# Altium schematic sheet Connectors.SchDoc
size A; SheetNumber: 4; SheetTotal: 6
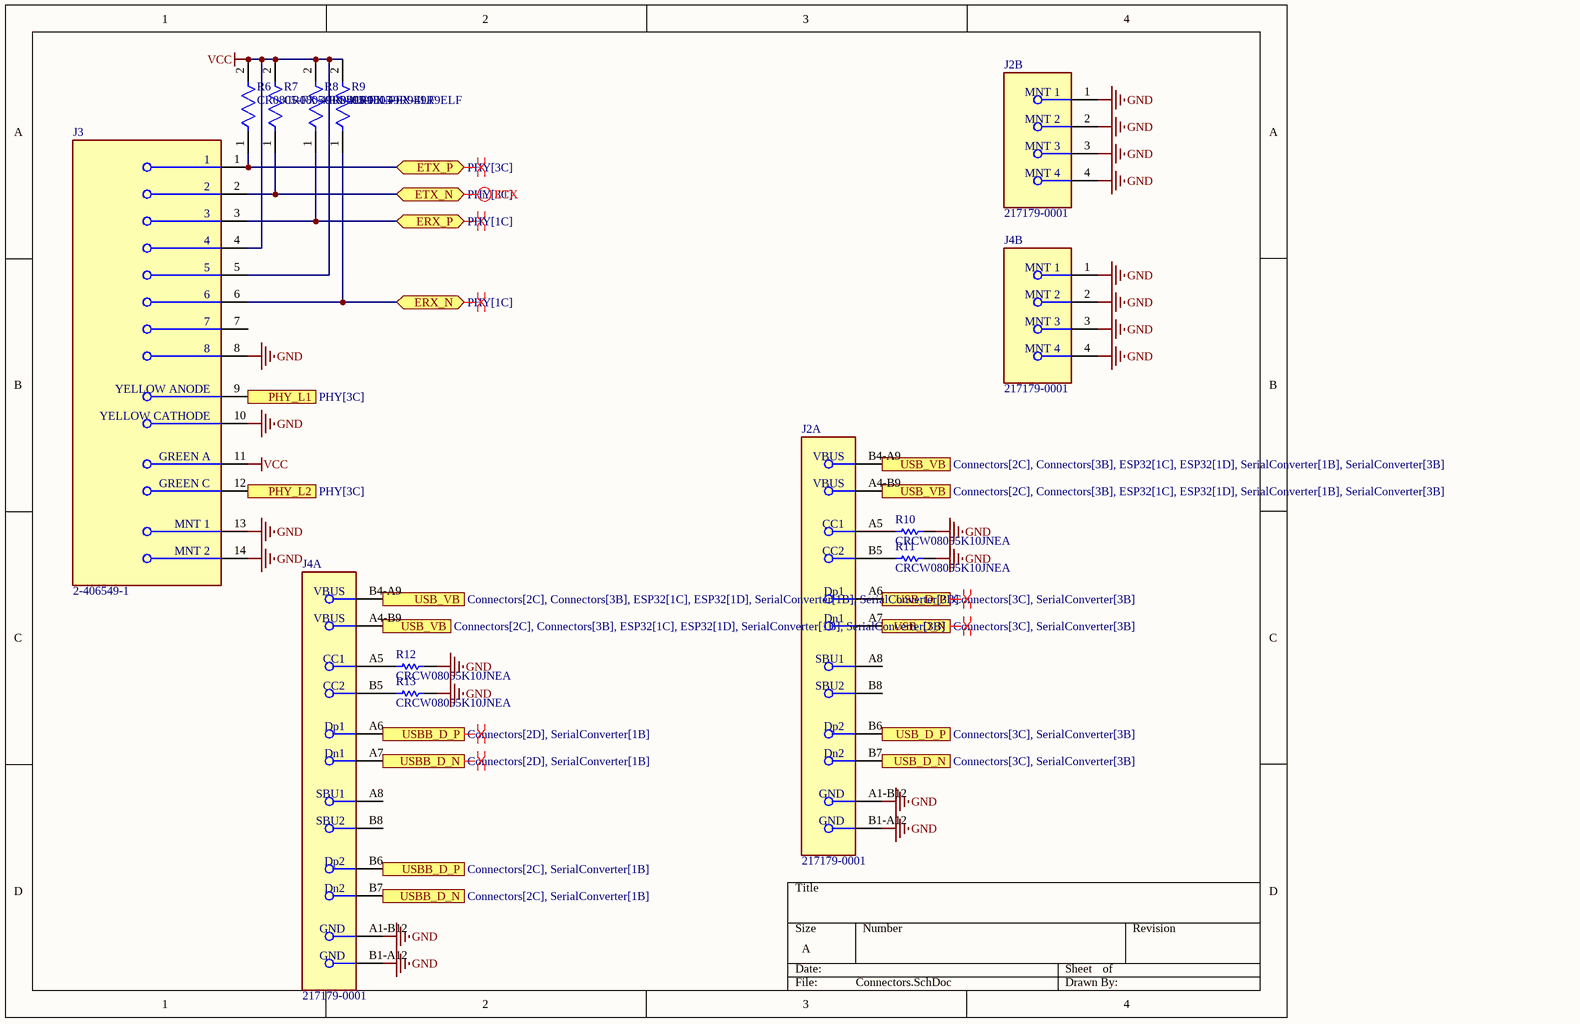
[diagram p0: Connectors.SchDoc]

## Parts
J2  217179-0001  [FP-217179-0001-MFG]  (parts A,B of 2)
J3  2-406549-1  [FP-2-406549-1-MFG]
J4  217179-0001  [FP-217179-0001-MFG]  (parts A,B of 2)
R6  CR0805-FX-49R9ELF  [FP-CR0805-MFG]
R7  CR0805-FX-49R9ELF  [FP-CR0805-MFG]
R8  CR0805-FX-49R9ELF  [FP-CR0805-MFG]
R9  CR0805-FX-49R9ELF  [FP-CR0805-MFG]
R10  CRCW08055K10JNEA  [RESC2013X50X30LL20T20]
R11  CRCW08055K10JNEA  [RESC2013X50X30LL20T20]
R12  CRCW08055K10JNEA  [RESC2013X50X30LL20T20]
R13  CRCW08055K10JNEA  [RESC2013X50X30LL20T20]

## Ports
ERX_N (bidir, see PHY[1C]), ERX_P (bidir, see PHY[1C]), ETX_N (bidir, see PHY[3C]), ETX_P (bidir, see PHY[3C]), PHY_L1 (in, see PHY[3C]), PHY_L2 (out, see PHY[3C]), USB_D_N (see Connectors[3C], SerialConverter[3B]), USB_D_P (see Connectors[3C], SerialConverter[3B]), USB_VB (see Connectors[2C], Connectors[3B], ESP32[1C], ESP32[1D], SerialConverter[1B], SerialConverter[3B]), USBB_D_N (see Connectors[2C], SerialConverter[1B]), USBB_D_N (see Connectors[2D], SerialConverter[1B]), USBB_D_P (see Connectors[2C], SerialConverter[1B]), USBB_D_P (see Connectors[2D], SerialConverter[1B])

## Nets
GND: J2.1(MNT_1) J2.2(MNT_2) J2.3(MNT_3) J2.4(MNT_4) J2.A1-B12(GND) J2.B1-A12(GND) J3.8 J3.10(YELLOW_CATHODE) J3.13(MNT_1) J3.14(MNT_2) J4.1(MNT_1) J4.2(MNT_2) J4.3(MNT_3) J4.4(MNT_4) J4.A1-B12(GND) J4.B1-A12(GND) R10.2 R11.2 R12.2 R13.2
VCC: J3.4 J3.5 J3.11(GREEN_A) R6.2 R7.2 R8.2 R9.2
ERX_N: J3.6 R9.1 ; port ERX_N
ERX_P: J3.3 R8.1 ; port ERX_P
ETX_N: J3.2 R7.1 ; port ETX_N
ETX_P: J3.1 R6.1 ; port ETX_P
PHY_L1: J3.9(YELLOW_ANODE) ; port PHY_L1
PHY_L2: J3.12(GREEN_C) ; port PHY_L2
USB_D_N: J2.A7(Dn1) J2.B7(Dn2) ; port USB_D_N
USB_D_P: J2.A6(Dp1) J2.B6(Dp2) ; port USB_D_P
USB_VB: J2.A4-B9(VBUS) J2.B4-A9(VBUS) J4.A4-B9(VBUS) J4.B4-A9(VBUS) ; port USB_VB
USBB_D_N: J4.A7(Dn1) J4.B7(Dn2) ; port USBB_D_N
USBB_D_P: J4.A6(Dp1) J4.B6(Dp2) ; port USBB_D_P
NetJ2_A5: J2.A5(CC1) R10.1
NetJ2_B5: J2.B5(CC2) R11.1
NetJ4_A5: J4.A5(CC1) R12.1
NetJ4_B5: J4.B5(CC2) R13.1

Not connected (* = marked no-connect by the designer): J2 A8(SBU1) B8(SBU2); J3 7; J4 A8(SBU1) B8(SBU2)

## Layout directives
differential pair: ERX_N, ERX_P, ETX_N, ETX_P, USB_D_N, USB_D_P, USBB_D_N, USBB_D_P

## Library data of the parts
J2 J4 = CMP-04767-000028-1: CONN RCP USB2.0 TYP C 24P SMD RA
J3 = CMP-2000-05541-2: CONN MOD JACK 8P8C R/A SHIELDED; Max Voltage Rating (AC): 150V; Number of Contacts: 8; PCB Mounting Orientation: Right Angle; Direction: Up; Pitch: 2.03mm; Number of Ports: 1; Gender: Female; Tail Length: 2.54mm; Current Rating: 1.5A; Keyed: No; Approvals: UL; PCB Thickness: 1.57mm; Element Configuration: Single; Connector Type: Jack; Color: Yellow; Max Operating Temperature: 85°C; Weight: 0.144729oz; Series: -; Orientation: Right Angle; Width: 17.27mm; Package Quantity: 63; Mount: Panel; Contact Plating: Gold; Length: 17.86mm; Depth: 15.75mm; Flammability Rating: UL94 V-0; Shielding: Shielded; Housing Material: Thermoplastic; Number of Positions Loaded: 8; Contact Material: Bronze; Voltage Rating: 150V; Packaging: Tray; Number of Positions: 8; Termination: Solder; Number of Rows: 1; Radiation Hardening: No; Min Operating Temperature: -40°C; RoHS Compliant: Yes; Housing Color: Black
R6-R9 = CMP-07231-001472-1: Thick Film Chip Resistors 0805 49.9Ω 0.125W 1% 100ppm/°C; Voltage Rating (DC): 150V; Power Rating: 125mW; Resistance: 49.9R; Contact Plating: Tin; Radiation Hardening: No; Height: 0.5mm; Tolerance: 1%; Temperature Coefficient: 100ppm/°C; Min Operating Temperature: -55°C; Thickness: 508um; Termination: SMD/SMT; Depth: 1.25mm; Length: 2mm; Number of Pins: 2; Military Standard: Not; Case Code (Metric): 2012; Package Quantity: 5000; Width: 1.25mm; Mount: Surface Mount; Case Code (Imperial): 0805; Max Operating Temperature: 155°C; Voltage Rating: 150V; Composition: Thick Film; Case/Package: 0805; Packaging: Tape and Reel; REACH SVHC: No SVHC
R10-R13 = CMP-2001-04025-1: Manufacturer: Vishay Dale; Part Number: CRCW08055K10JNEA